# Altium schematic sheet Controller.SchDoc
size A4; SheetNumber: 1; SheetTotal: 1
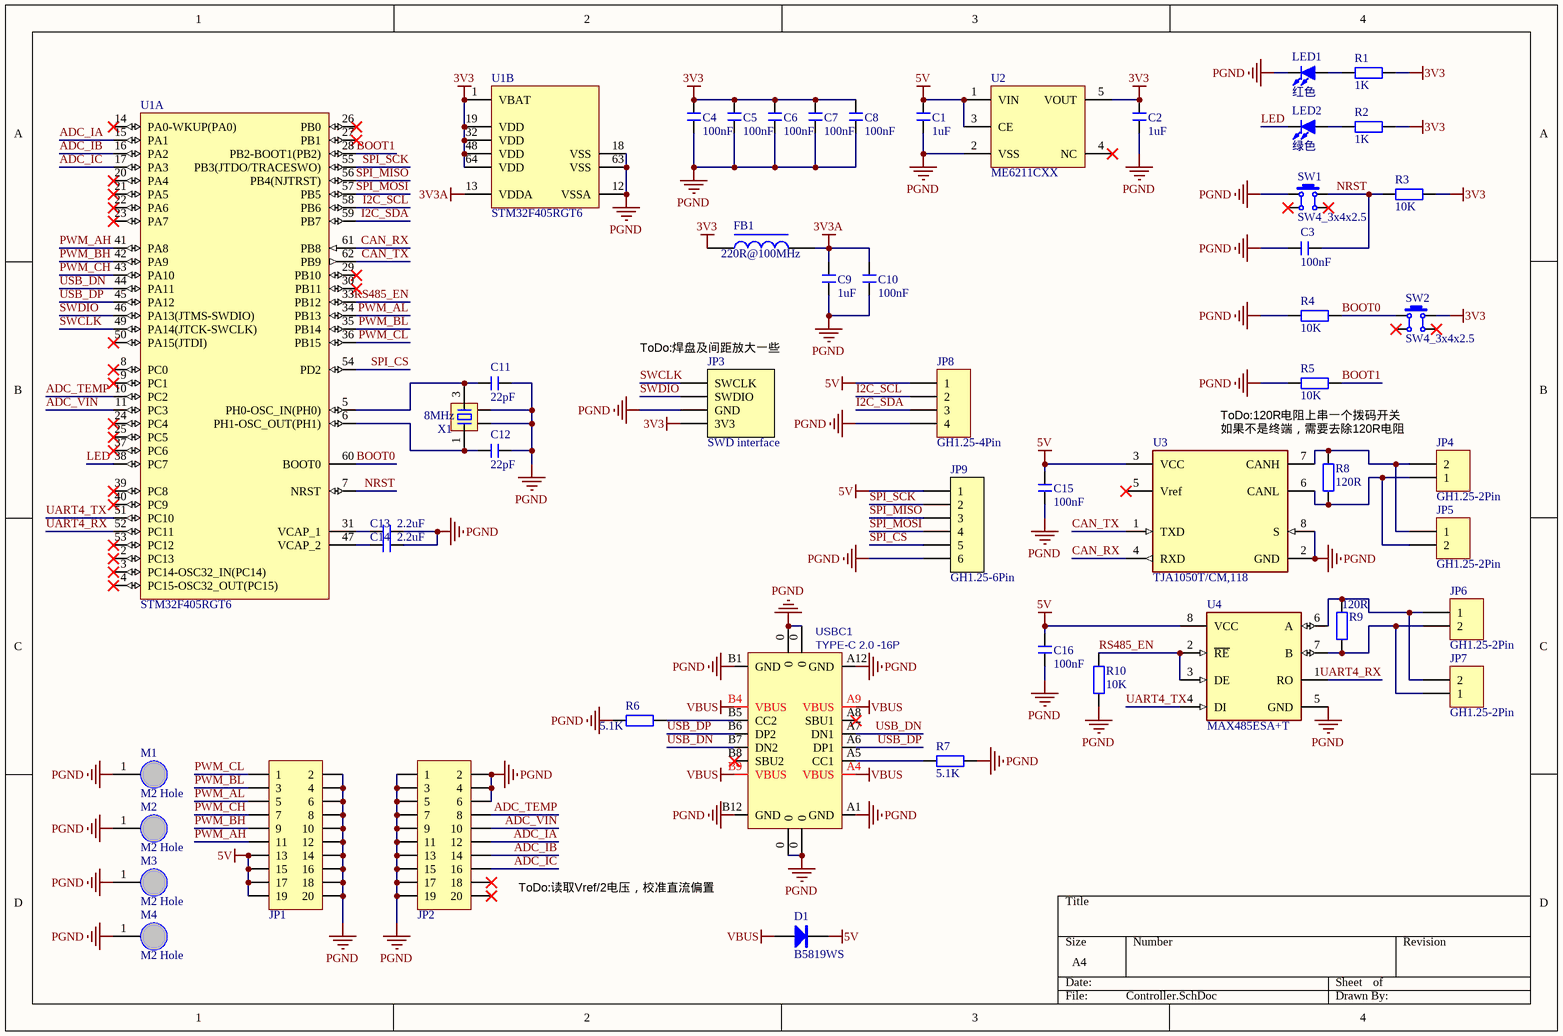
[diagram p0: Controller.SchDoc]

## Parts
C1  1uF  [Capacitor_0402_SMD]
C2  1uF  [Capacitor_0402_SMD]
C3  100nF  [Capacitor_0402_SMD]
C4  100nF  [Capacitor_0402_SMD]
C5  100nF  [Capacitor_0402_SMD]
C6  100nF  [Capacitor_0402_SMD]
C7  100nF  [Capacitor_0402_SMD]
C8  100nF  [Capacitor_0402_SMD]
C9  1uF  [Capacitor_0402_SMD]
C10  100nF  [Capacitor_0402_SMD]
C11  22pF  [Capacitor_0402_SMD]
C12  22pF  [Capacitor_0402_SMD]
C13  2.2uF  [Capacitor_0402_SMD]
C14  2.2uF  [Capacitor_0402_SMD]
C15  100nF  [Capacitor_0402_SMD]
C16  100nF  [Capacitor_0402_SMD]
D1  B5819WS  [SOD323]
FB1  220R@100MHz  [FerriteBead_0603_SMD]
JP1  Header 2X10  [HDR2.0-LI-2x10P]  (value not drawn)
JP2  Header 2X10  [HDR2.0-LI-2x10P]  (value not drawn)
JP3  SWD interface  [SWD_interface]  (no BOM)
JP4  GH1.25-2Pin  [A1257WR-S-XP-2Pin]
JP5  GH1.25-2Pin  [A1257WR-S-XP-2Pin]
JP6  GH1.25-2Pin  [A1257WR-S-XP-2Pin]
JP7  GH1.25-2Pin  [A1257WR-S-XP-2Pin]
JP8  GH1.25-4Pin  [A1257WR-S-XP-4Pin]
JP9  GH1.25-6Pin  [A1257WR-S-XP-6Pin]
LED1  红色  [LED_0603_SMD_RED]
LED2  绿色  [LED_0603_SMD_GREEN]
M1  M2 Hole  [M2 Hole]  (no BOM)
M2  M2 Hole  [M2 Hole]  (no BOM)
M3  M2 Hole  [M2 Hole]  (no BOM)
M4  M2 Hole  [M2 Hole]  (no BOM)
R1  1K  [Resistor_0402_SMD]
R2  1K  [Resistor_0402_SMD]
R3  10K  [Resistor_0402_SMD]
R4  10K  [Resistor_0402_SMD]
R5  10K  [Resistor_0402_SMD]
R6  5.1K  [Resistor_0402_SMD]
R7  5.1K  [Resistor_0402_SMD]
R8  120R  [Resistor_0402_SMD]
R9  120R  [Resistor_0402_SMD]
R10  10K  [Resistor_0402_SMD]
SW1  SW4_3x4x2.5  [SW4_3x4x2.5]
SW2  SW4_3x4x2.5  [SW4_3x4x2.5]
U1  STM32F405RGT6  [STM-LQFP64_L]  (parts A,B of 2)
U2  ME6211CXX  [ME6211CXX]
U3  TJA1050T/CM,118  [FP-SOT96-1-IPC_C]
U4  MAX485ESA+T  [FP-S8-2-IPC_C]
USBC1  TYPE-C 2.0 -16P  [USB-C-SMD_16P]
X1  8MHz  [OSC 3225-4P]

## Nets
3V3: C2.2 C4.2 C5.2 C6.2 C7.2 C8.2 FB1.1 JP3.4(3V3) R1.2 R2.2 R3.1 SW2.4 U1.1(VBAT) U1.19(VDD) U1.32(VDD) U1.48(VDD) U1.64(VDD) U2.5(VOUT)
3V3A: C9.2 C10.2 FB1.2 U1.13(VDDA)
5V: C1.2 C15.1 C16.1 D1.2(K) JP1.13 JP1.15 JP1.17 JP1.19 JP8.1 JP9.1 U2.1(VIN) U2.3(CE) U3.3(VCC) U4.8(VCC)
PGND: C1.1 C2.1 C3.2 C4.1 C5.1 C6.1 C7.1 C8.1 C9.1 C10.1 C11.1 C12.1 C13.1 C14.1 C15.2 C16.2 JP1.2 JP1.4 JP1.6 JP1.8 JP1.10 JP1.12 JP1.14 JP1.16 JP1.18 JP1.20 JP2.1 JP2.2 JP2.3 JP2.4 JP2.5 JP2.6 JP2.7 JP2.9 JP2.11 JP2.13 JP2.15 JP2.17 JP2.19 JP3.3(GND) JP8.4 JP9.6 LED1.2(K) M1.1(Hole) M2.1(Hole) M3.1(Hole) M4.1(Hole) R4.2 R5.2 R6.1 R7.2 R10.2 SW1.2 U1.12(VSSA) U1.18(VSS) U1.63(VSS) U2.2(VSS) U3.2(GND) U3.8(S) U4.5(GND) USBC1.0 USBC1.A1(GND) USBC1.A12(GND) USBC1.B1(GND) USBC1.B12(GND) X1.2 X1.4
VBUS: D1.1(A) USBC1.A4(VBUS) USBC1.A9(VBUS) USBC1.B4(VBUS) USBC1.B9(VBUS)
ADC_IA: JP2.12 U1.15(PA1)
ADC_IB: JP2.14 U1.16(PA2)
ADC_IC: JP2.16 U1.17(PA3)
ADC_TEMP: JP2.8 U1.10(PC2)
ADC_VIN: JP2.10 U1.11(PC3)
BOOT0: R4.1 SW2.2 U1.60(BOOT0)
BOOT1: R5.1 U1.28(PB2-BOOT1(PB2))
CAN_RX: U1.61(PB8) U3.4(RXD)
CAN_TX: U1.62(PB9) U3.1(TXD)
I2C_SCL: JP8.2 U1.58(PB6)
I2C_SDA: JP8.3 U1.59(PB7)
LED: LED2.2(K) U1.38(PC7)
NRST: C3.1 R3.2 SW1.4 U1.7(NRST)
PWM_AH: JP1.11 U1.41(PA8)
PWM_AL: JP1.5 U1.34(PB13)
PWM_BH: JP1.9 U1.42(PA9)
PWM_BL: JP1.3 U1.35(PB14)
PWM_CH: JP1.7 U1.43(PA10)
PWM_CL: JP1.1 U1.36(PB15)
RS485_EN: R10.1 U1.33(PB12) U4.2(~{RE}) U4.3(DE)
SPI_CS: JP9.5 U1.54(PD2)
SPI_MISO: JP9.3 U1.56(PB4(NJTRST))
SPI_MOSI: JP9.4 U1.57(PB5)
SPI_SCK: JP9.2 U1.55(PB3(JTDO/TRACESWO))
SWCLK: JP3.1(SWCLK) U1.49(PA14(JTCK-SWCLK))
SWDIO: JP3.2(SWDIO) U1.46(PA13(JTMS-SWDIO))
UART4_RX: U1.52(PC11) U4.1(RO)
UART4_TX: U1.51(PC10) U4.4(DI)
USB_DN: U1.44(PA11) USBC1.A7(DN1) USBC1.B7(DN2)
USB_DP: U1.45(PA12) USBC1.A6(DP1) USBC1.B6(DP2)
NetC11_2: C11.2 U1.5(PH0-OSC_IN(PH0)) X1.3
NetC12_2: C12.2 U1.6(PH1-OSC_OUT(PH1)) X1.1
NetC13_2: C13.2 U1.31(VCAP_1)
NetC14_2: C14.2 U1.47(VCAP_2)
NetJP4_1: JP4.1 JP5.2 R8.2 U3.6(CANL)
NetJP4_2: JP4.2 JP5.1 R8.1 U3.7(CANH)
NetJP6_1: JP6.1 JP7.2 R9.1 U4.6(A)
NetJP6_2: JP6.2 JP7.1 R9.2 U4.7(B)
NetLED1_1: LED1.1(A) R1.1
NetLED2_1: LED2.1(A) R2.1
NetR6_2: R6.2 USBC1.B5(CC2)
NetR7_1: R7.1 USBC1.A5(CC1)

Not connected (* = marked no-connect by the designer): JP2 18* 20*; SW1 1* 3*; SW2 1* 3*; U1 2(PC13)* 3(PC14-OSC32_IN(PC14))* 4(PC15-OSC32_OUT(PC15))* 8(PC0)* 9(PC1)* 14(PA0-WKUP(PA0))* 20(PA4)* 21(PA5)* 22(PA6)* 23(PA7)* 24(PC4)* 25(PC5)* 26(PB0)* 27(PB1)* 29(PB10)* 30(PB11)* 37(PC6)* 39(PC8)* 40(PC9)* 50(PA15(JTDI))* 53(PC12)*; U2 4(NC)*; U3 5(Vref)*; USBC1 A8(SBU1)* B8(SBU2)*

## Notes on the sheet
- (near JP3) ToDo:焊盘及间距放大一些
- 如果不是终端，需要去除120R电阻
- ToDo:120R电阻上串一个拨码开关
- (near JP2) ToDo:读取Vref/2电压，校准直流偏置

## Library data of the parts
C1-C16 = C: 无极性贴片电容; 版权归属: 源创客; BOM名称: 无极性贴片电容; 学习资源: www.ooocke.com
D1 = 1N5819: 肖特基二极管; 版权归属: 源创客; 属性: 40V/2A; BOM名称: 肖特基二极管; 学习资源: www.ooocke.com
FB1 = FerriteBead: Value: 220R@100MHz
JP1 JP2 = Header 10X2: 10*2P接插件; 封装库来自淘宝卖家 ID：黄晶宝石: 其他店铺购入均为盗版假冒封装库; 联系卖家，免费查找封装: 唯一出售店铺网址https://shop463601444.taobao.com; BOM名称: 10*2P接插件
JP3 = SWD_interface
JP4-JP7 = GH1.25-2Pin: CJTconn A1257 Series 1.25mm pitch wire to board connector
JP8 = GH1.25-4Pin: CJTconn A1257 Series 1.25mm pitch wire to board connector
JP9 = GH1.25-6Pin: CJTconn A1257 Series 1.25mm pitch wire to board connector
LED1 LED2 = LED-SMD: 贴片LED; 版权归属: 源创客; BOM名称: 贴片LED; 学习资源: www.ooocke.com
M1-M4 = M2_hole
R1-R10 = R: 贴片电阻; 版权归属: 源创客; BOM名称: 贴片电阻; 学习资源: www.ooocke.com
U1 = CMP-0243-00019-3: ARM Cortex-M4 32-bit MCU+FPU, 210 DMIPS, 1024 kB Flash, 192 kB Internal RAM, 51 I/Os, 64-pin LQFP, -40 to 85 degC, Tray; Manufacturer: STMicroelectronics; Supply Voltage(Vcc) min (V): 1.8; Supply Voltage(Vcc) max (V): 3.6; Internal RAM Size (kB): 192; I/Os (High Current): 51; D/A Converter: 2x12-bit; FLASH Size (Prog) (kB): 1024; Operating Frequency(F) (Processor speed) (MHz): 168; ComponentLink2Description: Datasheet; PackageVersion: Rev. 4, 06/2013; DatasheetVersion: Rev. 4; Core: ARM Cortex-M4; ComponentLink2URL: http://www.st.com/st-web-ui/static/active/en/resource/technical/document/datasheet/DM00037051.pdf; PackageReference: LQFP64; Packing: Tray; ComponentLink1Description: Manufacturer URL; ComponentLink3URL: http://www.st.com/st-web-ui/static/active/en/resource/technical/document/datasheet/DM00037051.pdf; ComponentLink3Description: Package Specification; Mounting Technology: Surface Mount; ComponentLink1URL: http://www.st.com/web/en/home.html; PackageDescription: 64-Pin Low Profile Quad Flat Package, 10 x 10 mm Body, 0.5 mm Pitch; PartNumber: STM32F405RGT6
U2 = ME6211CXX: 高精度、高纹波抑制比、低噪声、超快响应 LDO
U3 = CMP-2000-04923-2: IC TRANSCEIVER HALF 1/1 8SO; Simplex/Duplex: Half Duplex; Max Supply Current: 10mA; Number of Receive Buffers: 1; Min Supply Voltage: 4.75V; Max Supply Voltage: 5.25V; Interface: CAN; Data Rate: 1Mbps; Receiver Hysteresis: 70mV; Number of Transmit Buffers: 1; Min Operating Temperature: -40°C; Case/Package: SO; REACH SVHC: No SVHC; Max Operating Temperature: 150°C; Number of Pins: 8; Lead Free: Lead Free; Number of Transceivers: 1; Packaging: Tape and Reel; Mount: Surface Mount; Radiation Hardening: No; Nominal Supply Current: 10mA; Package Quantity: 2500; Contact Plating: Gold
U4 = CMP-05679-000009-1: IC TRANSCEIVER HALF 1/1 8SOIC; Manufacturer: Maxim Integrated; Min Supply Voltage: 4.75V; Nominal Supply Current: 0.5mA; Number Of Transmitters: 1; Data Rate: 2.5Mbits/s; Interface: RS-485,RS-422; Standoff Height: 0.1mm; Max Supply Voltage: 5.25V; Simplex Duplex: Half-Duplex; Package: S8-2; Temperature: -40°C to +85°C; Device Class L1: Integrated Circuits (ICs); Footprint Url: https://pdfserv.maximintegrated.com/land_patterns/90-0096.PDF; ComponentLink2URL: https://datasheets.maximintegrated.com/en/ds/MAX1487-MAX491.pdf; Height: 1.75mm; Mouser Description: RS-422/RS-485 Interface IC RS-485/RS-422 Transceiver; Octopart: https://octopart.com/max485esa%2Bt-maxim+integrated-40011239; RoHS: TRUE; ComponentLink2Description: Datasheet; Temperature Range Low: -40°C; Number Of Receivers: 1; Manufacturer Part Number: MAX485ESA+T; Ipc Land Pattern Name: SOIC127P600X155-8; Device Class L3: RS-232 / RS-422 / RS-485 Interface ICs; Automotive: No; Digikey Description: IC TRANSCEIVER HALF 1/1 8SOIC; Temperature Range High: +85°C; Category: IC; Device Class L2: Interface ICs; Lead Free: Yes
USBC1 = USB2.0_Type-C_16Pin: USB2.0_Type-C_16Pin母座; 联系卖家 免费查找封装: 唯一出售店铺网址https://shop463601444.taobao.com; 联系卖家 免费技术支持: 封装库来自淘宝卖家ID：黄晶宝石
X1 = XTAL-4P: 4脚无源晶振; 版权归属: 源创客; BOM名称: 4脚无源晶振; 学习资源: www.ooocke.com